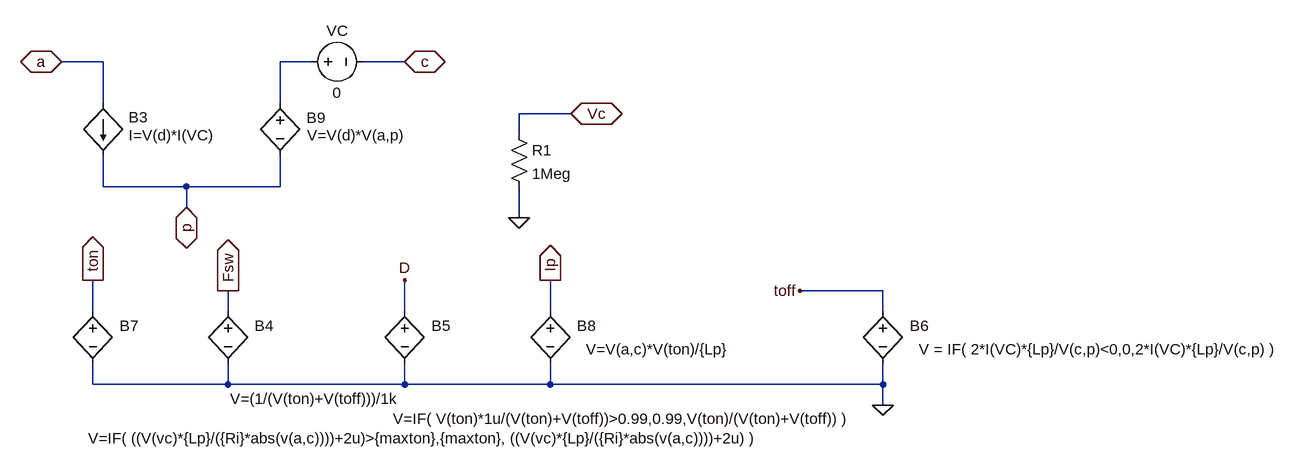
[diagram p0: schematic PWMBCMCM2.asc]
PWMBCMCM2.asc, the LTspice schematic file:
Version 4.1
SHEET 1 1564 680
WIRE -352 -1008 -416 -1008
WIRE -32 -1008 -80 -1008
WIRE 112 -1008 48 -1008
WIRE -352 -944 -352 -1008
WIRE -80 -944 -80 -1008
WIRE 368 -928 288 -928
WIRE 288 -896 288 -928
WIRE -352 -816 -352 -864
WIRE -224 -816 -352 -816
WIRE -80 -816 -80 -864
WIRE -80 -816 -224 -816
WIRE -224 -784 -224 -816
WIRE 288 -768 288 -816
WIRE 848 -656 720 -656
WIRE -368 -624 -368 -672
WIRE -160 -624 -160 -656
WIRE 112 -624 112 -672
WIRE 336 -624 336 -672
WIRE 848 -624 848 -656
WIRE -368 -512 -368 -544
WIRE -160 -512 -160 -544
WIRE -160 -512 -368 -512
WIRE 112 -512 112 -544
WIRE 112 -512 -160 -512
WIRE 336 -512 336 -544
WIRE 336 -512 112 -512
WIRE 848 -512 848 -544
WIRE 848 -512 336 -512
WIRE 848 -480 848 -512
FLAG -416 -1008 a
IOPIN -416 -1008 BiDir
FLAG 112 -1008 c
IOPIN 112 -1008 BiDir
FLAG -224 -784 p
IOPIN -224 -784 BiDir
FLAG -160 -656 Fsw
IOPIN -160 -656 Out
FLAG 112 -672 D
FLAG 720 -656 toff
FLAG 848 -480 0
FLAG -368 -672 ton
IOPIN -368 -672 Out
FLAG 336 -672 Ip
IOPIN 336 -672 Out
FLAG 368 -928 Vc
IOPIN 368 -928 BiDir
FLAG 288 -768 0
SYMBOL bi -352 -944 R0
WINDOW 0 39 21 Left 2
WINDOW 3 39 49 Left 2
SYMATTR InstName B3
SYMATTR Value I=V(d)*I(VC)
SYMBOL voltage -48 -1008 R270
WINDOW 0 32 56 VTop 2
WINDOW 3 -32 56 VBottom 2
SYMATTR InstName VC
SYMATTR Value 0
SYMBOL bv -160 -640 R0
WINDOW 0 41 38 Left 2
WINDOW 3 3 150 Left 2
SYMATTR InstName B4
SYMATTR Value V=(1/(V(ton)+V(toff)))/1k
SYMBOL bv 112 -640 R0
WINDOW 0 41 38 Left 2
WINDOW 3 -18 181 Left 2
SYMATTR InstName B5
SYMATTR Value V=IF( V(ton)*1u/(V(ton)+V(toff))>0.99,0.99,V(ton)/(V(ton)+V(toff)) )
SYMBOL bv 848 -640 R0
WINDOW 0 41 38 Left 2
WINDOW 3 55 74 Left 2
SYMATTR InstName B6
SYMATTR Value V = IF( 2*I(VC)*{Lp}/V(c,p)<0,0,2*I(VC)*{Lp}/V(c,p) )
SYMBOL bv -368 -640 R0
WINDOW 0 41 38 Left 2
WINDOW 3 -7 211 Left 2
SYMATTR InstName B7
SYMATTR Value V=IF( ((V(vc)*{Lp}/({Ri}*abs(v(a,c))))+2u)>{maxton},{maxton}, ((V(vc)*{Lp}/({Ri}*abs(v(a,c))))+2u) )
SYMBOL bv 336 -640 R0
WINDOW 0 41 38 Left 2
WINDOW 3 55 74 Left 2
SYMATTR InstName B8
SYMATTR Value V=V(a,c)*V(ton)/{Lp}
SYMBOL bv -80 -960 R0
WINDOW 0 41 38 Left 2
WINDOW 3 42 65 Left 2
SYMATTR InstName B9
SYMATTR Value V=V(d)*V(a,p)
SYMBOL res 272 -912 R0
SYMATTR InstName R1
SYMATTR Value 1Meg

The netlist it stands for:
* PWMBCMCM2.asc
B3 a p I=V(d)*I(VC)
VC N001 c 0
B4 Fsw 0 V=(1/(V(ton)+V(toff)))/1k
B5 D 0 V=IF( V(ton)*1u/(V(ton)+V(toff))>0.99,0.99,V(ton)/(V(ton)+V(toff)) )
B6 toff 0 V = IF( 2*I(VC)*{Lp}/V(c,p)<0,0,2*I(VC)*{Lp}/V(c,p) )
B7 ton 0 V=IF( ((V(vc)*{Lp}/({Ri}*abs(v(a,c))))+2u)>{maxton},{maxton}, ((V(vc)*{Lp}/({Ri}*abs(v(a,c))))+2u) )
B8 Ip 0 V=V(a,c)*V(ton)/{Lp}
B9 N001 p V=V(d)*V(a,p)
R1 Vc 0 1Meg
.backanno
.end